# EAGLE schematic try1 (EAGLE 9.6.2)

## Sheet 1 of 2
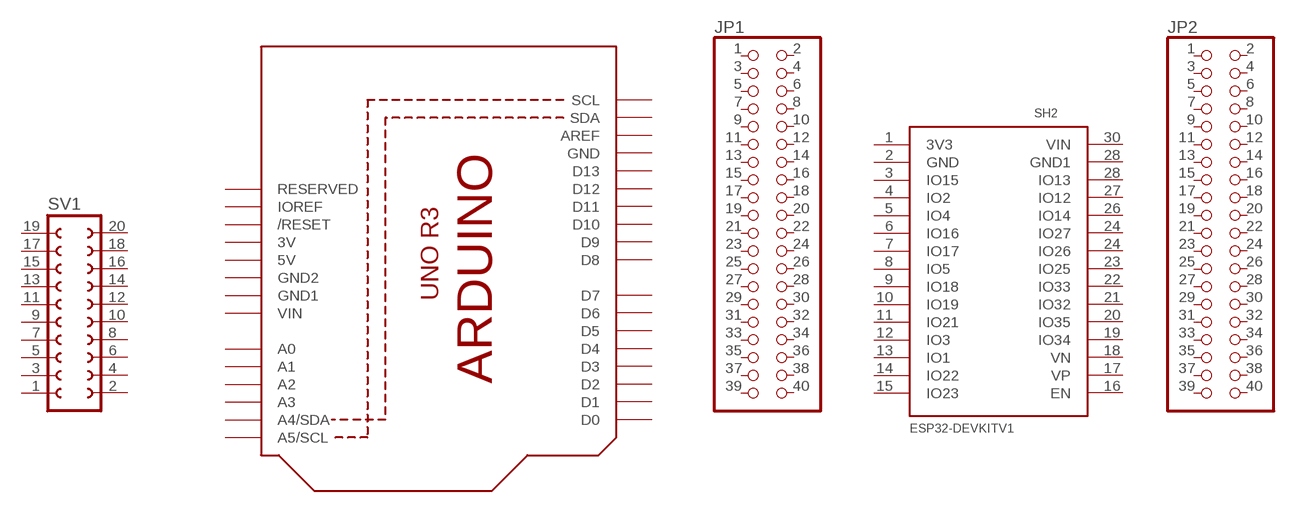
[diagram p0: schematic, sheet 1]

### Parts
JP1  PINHD-2X20  [2X20]
JP2  PINHD-2X20  [2X20]
SH1  ARDUINOR3-BPLACE  [ARDUINOR3-BPLACE]
SH2  ESP32DEVKITV1  [ESP32-DEVKITV1]
SV1  FE10-2  [FE10-2]
Unconnected: JP1.1 JP1.2 JP1.3 JP1.4 JP1.5 JP1.6 JP1.7 JP1.8 JP1.9 JP1.10 JP1.11 JP1.12 JP1.13 JP1.14 JP1.15 JP1.16 JP1.17 JP1.18 JP1.19 JP1.20 JP1.21 JP1.22 JP1.23 JP1.24 JP1.25 JP1.26 JP1.27 JP1.28 JP1.29 JP1.30 JP1.31 JP1.32 JP1.33 JP1.34 JP1.35 JP1.36 JP1.37 JP1.38 JP1.39 JP1.40 JP2.1 JP2.2 JP2.3 JP2.4 JP2.5 JP2.6 JP2.7 JP2.8 JP2.9 JP2.10 JP2.11 JP2.12 JP2.13 JP2.14 JP2.15 JP2.16 JP2.17 JP2.18 JP2.19 JP2.20 JP2.21 JP2.22 JP2.23 JP2.24 JP2.25 JP2.26 JP2.27 JP2.28 JP2.29 JP2.30 JP2.31 JP2.32 JP2.33 JP2.34 JP2.35 JP2.36 JP2.37 JP2.38 JP2.39 JP2.40 SH1.A0 SH1.A1 SH1.A2 SH1.A3 SH1.A4(A4/SDA) SH1.A5(A5/SCL) SH1.AREF SH1.D0 SH1.D1 SH1.D2 SH1.D3 SH1.D4 SH1.D5 SH1.D6 SH1.D7 SH1.D8 SH1.D9 SH1.D10 SH1.D11 SH1.D12 SH1.D13 SH1.IOREF SH1.RESERVED SH1.RESET(/RESET) SH1.SCL SH1.SDA SH2.1(3V3) SH2.2(GND) SH2.3(IO15) SH2.4(IO2) SH2.5(IO4) SH2.6(IO16) SH2.7(IO17) SH2.8(IO5) SH2.9(IO18) SH2.10(IO19) SH2.11(IO21) SH2.12(IO3) SH2.13(IO1) SH2.14(IO22) SH2.15(IO23) SH2.16(EN) SH2.17(VP) SH2.18(VN) SH2.19(IO34) SH2.20(IO35) SH2.21(IO32) SH2.22(IO33) SH2.23(IO25) SH2.24(IO26) SH2.24(IO27) SH2.26(IO14) SH2.27(IO12) SH2.28(GND1) SH2.28(IO13) SH2.30(VIN) SV1.1 SV1.2 SV1.3 SV1.4 SV1.5 SV1.6 SV1.7 SV1.8 SV1.9 SV1.10 SV1.11 SV1.12 SV1.13 SV1.14 SV1.15 SV1.16 SV1.17 SV1.18 SV1.19 SV1.20

## Sheet 2 of 2
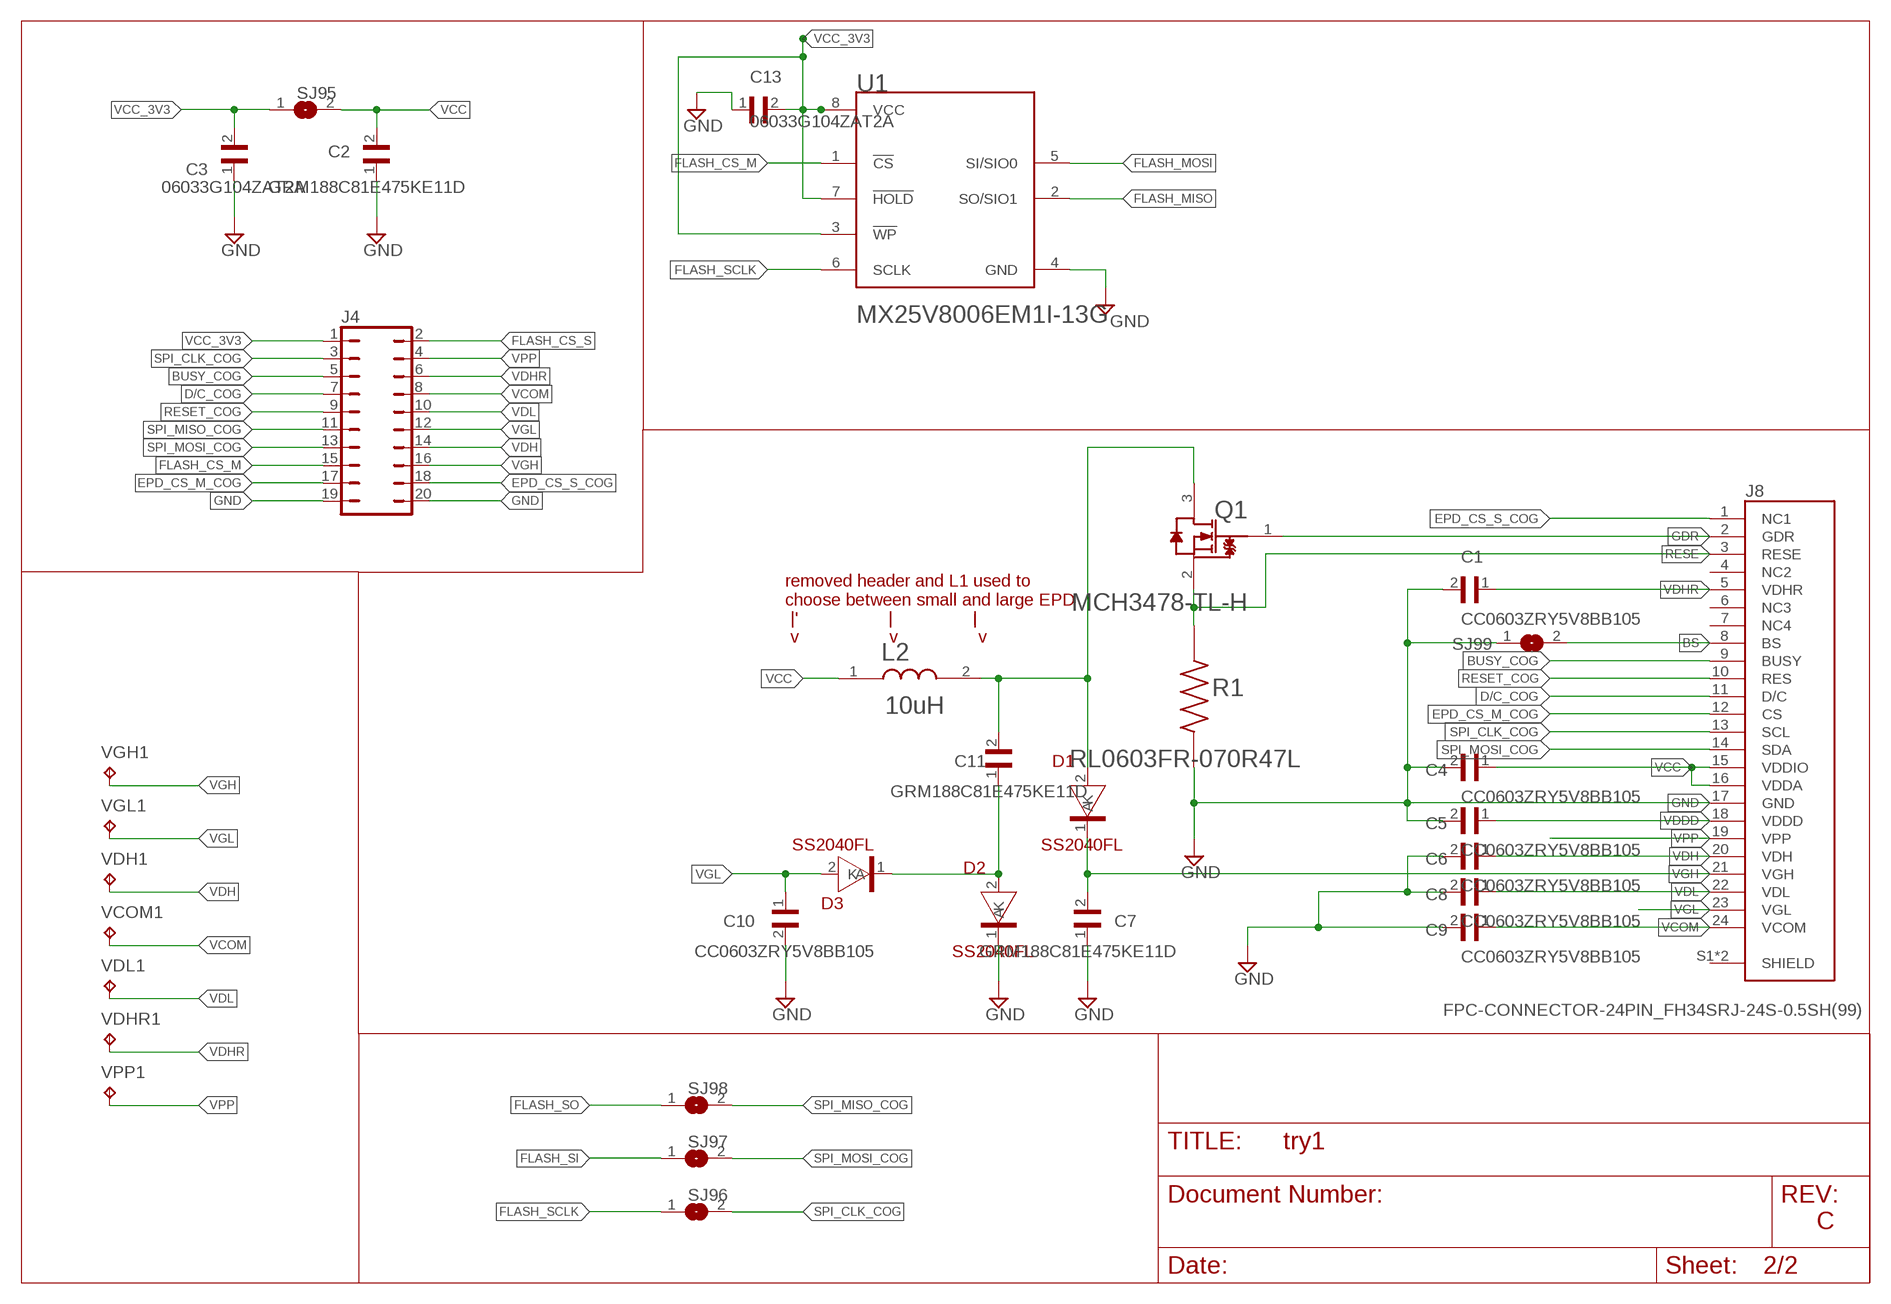
[diagram p1: schematic, sheet 2]

### Parts
C1  CC0603ZRY5V8BB105  [CAPC1608X90]
C2  GRM188C81E475KE11D  [CAPC1608X100N]
C3  06033G104ZAT2A  [CAPC1608X90N]
C4  CC0603ZRY5V8BB105  [CAPC1608X90]
C5  CC0603ZRY5V8BB105  [CAPC1608X90]
C6  CC0603ZRY5V8BB105  [CAPC1608X90]
C7  GRM188C81E475KE11D  [CAPC1608X100N]
C8  CC0603ZRY5V8BB105  [CAPC1608X90]
C9  CC0603ZRY5V8BB105  [CAPC1608X90]
C10  CC0603ZRY5V8BB105  [CAPC1608X90]
C11  GRM188C81E475KE11D  [CAPC1608X100N]
C13  06033G104ZAT2A  [CAPC1608X90N]
D1  SS2040FL  [SOD-123FL]
D2  SS2040FL  [SOD-123FL]
D3  SS2040FL  [SOD-123FL]
J4  JP10Q  [JP10Q]
J8  FPC-CONNECTOR-24PIN_FH34SRJ-24S-0.5SH(99)  [FPC-CONNECTOR-24PIN_HRS_FH34SRJ-24S-0.5SH(99)]
L2  MURATA_LQH3NPZ100MMELMURATA_LQH3NPZ100MMEL_0_0  [MURATA_LQH3NPZ100MMEL_0]
Q1  ON_SEMICONDUCTOR_MCH3478-TL-HON_SEMICONDUCTOR_MCH3478-TL-H_0_0  [ON_SEMICONDUCTOR_MCH3478-TL-H_0]
R1  RL0603FR-070R47L  [RESC1608X55N]
SJ95  SJW  [SJW]
SJ96  SJW  [SJW]
SJ97  SJW  [SJW]
SJ98  SJW  [SJW]
SJ99  SJW  [SJW]
U1  MACRONIX_MX25V8006EM1I-13GMACRONIX_MX25V8006EM1I-13G_0_0  [MACRONIX_MX25V8006EM1I-13G_0]
VCOM1  TPB1,27  [B1,27]
VDH1  TPB1,27  [B1,27]
VDHR1  TPB1,27  [B1,27]
VDL1  TPB1,27  [B1,27]
VGH1  TPB1,27  [B1,27]
VGL1  TPB1,27  [B1,27]
VPP1  TPB1,27  [B1,27]

### Nets
BS: J8.8(BS) SJ99.2
BUSY_COG: J4.5 J8.9(BUSY)
D/C_COG: J4.7 J8.11(D/C)
EPD_CS_M_COG: J4.17 J8.12(CS)
EPD_CS_S_COG: J4.18 J8.1(NC1)
FLASH_CS_M: J4.15 U1.1(!CS!)
FLASH_CS_S: J4.2
FLASH_MISO: U1.2(SO/SIO1)
FLASH_MOSI: U1.5(SI/SIO0)
FLASH_SCLK: SJ96.1 U1.6(SCLK)
FLASH_SI: SJ97.1
FLASH_SO: SJ98.1
GDR: J8.2(GDR) Q1.1(G)
GND: C1.2 C2.1 C3.1 C4.2 C5.2 C6.2 C7.1 C8.2 C9.2 C10.2 C13.1 D2.1(K) J4.19 J4.20 J8.17(GND) R1.1 SJ99.1 U1.4(GND)
N$1: C11.2 D1.2(A) L2.2 Q1.3(D)
N$15: C11.1 D2.2(A) D3.1(K)
RESE: J8.3(RESE) Q1.2(S) R1.2
RESET_COG: J4.9 J8.10(RES)
SPI_CLK_COG: J4.3 J8.13(SCL) SJ96.2
SPI_MISO_COG: J4.11 SJ98.2
SPI_MOSI_COG: J4.13 J8.14(SDA) SJ97.2
VCC: C2.2 C4.1 J8.15(VDDIO) J8.16(VDDA) L2.1 SJ95.2
VCC_3V3: C3.2 C13.2 J4.1 SJ95.1 U1.3(!WP!) U1.7(!HOLD!) U1.8(VCC)
VCOM: C9.1 J4.8 J8.24(VCOM) VCOM1.TP
VDDD: C5.1 J8.18(VDDD)
VDH: C6.1 J4.14 J8.20(VDH) VDH1.TP
VDHR: C1.1 J4.6 J8.5(VDHR) VDHR1.TP
VDL: C8.1 J4.10 J8.22(VDL) VDL1.TP
VGH: C7.2 D1.1(K) J4.16 J8.21(VGH) VGH1.TP
VGL: C10.1 D3.2(A) J4.12 J8.23(VGL) VGL1.TP
VPP: J4.4 J8.19(VPP) VPP1.TP
Unconnected: J8.4(NC2) J8.6(NC3) J8.7(NC4) J8.S1(SHIELD) J8.S2(SHIELD)

### Notes on the sheet
- removed header and L1 used to 
  choose between small and large EPD
   |'                  |                |
   v                  v                v
- C

## Power pins joined to a net without a drawn wire
3V: SH1.3V
5V: SH1.5V
GND: SH1.GND
GND1: SH1.GND1
GND2: SH1.GND2
VIN: SH1.VIN

## Library data of the parts
C1 C4-C6 C8-C10 = CAP 1uF:CC0603ZRY5V8BB105: Cap 1uF 25VDC Y5V -20% to 80% SMD 0603 Paper T/R; DESCRIPTION: 1µF -20%, +80% 25V Ceramic Capacitor Y5V (F) 0603 (1608 Metric); DIGI-KEY_PART_NUMBER: 311-1829-1-ND; MF: Yageo; MP: CC0603ZRY5V8BB105; PACKAGE: 0603 Yageo; PURCHASE-URL: https://pricing.snapeda.com/search/part/CC0603ZRY5V8BB105/?ref=eda
C2 C7 C11 = CAP 4.7uF:GRM188C81E475KE11D: Cap Ceramic 4.7uF 25V X6S 10% Pad SMD 0603 105C T/R Check prices <https://pricing.snapeda.com/parts/GRM188C81E475KE11D/Murata/view-part?ref=eda>; AVAILABILITY: In Stock; DESCRIPTION: SMD Capacitor X6S(EIA) with Capacitance: 4.7uF Tol. 10%. Rated Voltage: 25Vdc; MF: Murata; MP: GRM188C81E475KE11D; PACKAGE: 1608 Murata; PRICE: None; PURCHASE-URL: https://pricing.snapeda.com/search/part/GRM188C81E475KE11D/?ref=eda
C3 C13 = CAP 100nF:06033G104ZAT2A: 0603 100 nF 25 V -20 / +80 % Tolerance Y5V SMT Multilayer Ceramic Capacitor; DESCRIPTION: Cap Ceramic 0.1uF 25V Y5V -20% to 80% Pad SMD 0603 85°C T/R; MF: AVX; MP: 06033G104ZAT2A; PACKAGE: None; PURCHASE-URL: https://pricing.snapeda.com/search/part/06033G104ZAT2A/?ref=eda
D1-D3 = DIODE:SS2040FL: Check prices <https://pricing.snapeda.com/parts/SS2040FL/Panjit/view-part?ref=eda>; AVAILABILITY: In Stock; DESCRIPTION: Schottky Diodes & Rectifiers GP/TR/13/RoHS/10K/SOD-123FL/SKY/SOD/SSM-20AAFL/SSM20FL-QI02/PJ///; MF: Panjit; MP: SS2040FL; PACKAGE: None; PRICE: None; PURCHASE-URL: https://pricing.snapeda.com/search/part/SS2040FL/?ref=eda
J4 = jumper:JP10Q: JUMPER
J8 = ESL:FPC-CONNECTOR-24PIN_FH34SRJ-24S-0.5SH(99): FFC & FPC Connectors Check prices <https://pricing.snapeda.com/parts/FH34SRJ-24S-0.5SH%2899%29/Hirose%20Electric/view-part?ref=eda>; AVAILABILITY: In Stock; DESCRIPTION: 24 Position FFC, FPC Connector Contacts, Top and Bottom 0.020 (0.50mm) Surface Mount, Right Angle; MF: Hirose Electric; MP: FH34SRJ-24S-0.5SH(99); PACKAGE: None; PRICE: None; PURCHASE-URL: https://pricing.snapeda.com/search/part/FH34SRJ-24S-0.5SH(99)/?ref=eda
JP1 JP2 = pinhead:PINHD-2X20: PIN HEADER
L2 = IND 10uH:MURATA_LQH3NPZ100MMEL: Wire Wound Ferrite Inductor for Power Lines For Automotive 10μH ±20% 0.228Ω 1280mA 1212; AMBIENT_TEMPERATURE_RANGE_HIGH: +105°C; AMBIENT_TEMPERATURE_RANGE_LOW: -40°C; AUTOMOTIVE: Yes; AUTOMOTIVE_GRADE: Grade 1; CENTROID_NOT_SPECIFIED: No; COMPOSITION: Wirewound; CORE_MATERIAL: Ferrite; DATASHEET: https://www.murata.com/en-us/products/productdetail?partno=LQH3NPZ100MME%23; DEVICE_CLASS_L1: Passive Components; DEVICE_CLASS_L2: Inductors; DEVICE_CLASS_L3: Fixed Inductors; FOOTPRINT_VARIANT_NAME_0: Recommended_Land_Pattern; HEIGHT: 1.5mm; INDUCTANCE: 10uH; LEAD_FREE: Yes; MF: Murata; MFG_PACKAGE_IDENT: LQH3NPH_ME; MFG_PACKAGE_IDENT_COMPONENT_ID: a63315cd171c542c; MFG_PACKAGE_IDENT_DATE: 0; MFG_PACKAGE_IDENT_REV: 0; MPN: LQH3NPZ100MMEL; PACKAGE: 1212.0; PREFIX: L; RMS_CURRENT: 1280mA; ROHS: Yes; SATURATION_CURRENT: 810mA; SELF_RESONANT_FREQUENCY: 20MHz; SERIES_RESISTANCE: 0.228Ω; SHIELDING: true; TEMPERATURE_RANGE_HIGH: +125°C; TEMPERATURE_RANGE_LOW: -40°C; TEST_FREQUENCY: 1MHz; TOLERANCE: 0.2; VERIFICATION_VERSION: 0.0.0.3
Q1 = MOSFET:ON_SEMICONDUCTOR_MCH3478-TL-H: ONSC-NMOS-G1S2D3-3_J; CHANNEL_POLARITY: N Channel; CIIVA_IDS: 837008; CISS_TYP_PF: 130; COMPONENT_LINK_1_DESCRIPTION: Manufacturer URL; COMPONENT_LINK_1_URL: http://www.onsemi.com/; COMPONENT_LINK_3_DESCRIPTION: Package Specification; COMPONENT_LINK_3_URL: http://www.onsemi.com/pub_link/Collateral/EN7354-D.PDF; CONFIGURATION: Single; COSS_TYP_PF: 21; CRSS_TYP_PF: 14; DATASHEET: http://www.onsemi.cn/pub_link/Collateral/ENAA1353-D.PDF; FOOTPRINT_VARIANT_NAME_0: Manufacturer Recommended; IMPORTED: yes; IMPORTED_FROM: vault; IMPORT_TS: 1521851194; MF: On Semiconductor; MOUNTING_TECHNOLOGY: Surface Mount; MPN: MCH3478-TL-H; PACKAGE: MCPH-3; PACKAGE_DESCRIPTION: 3-Pin Small Outline Transistor, Body 2 x 1.6 mm, Pitch 0.65 mm; PACKAGE_TYPE: SC-70FL / MCPH-3; PACKING: Tape and Reel; PREFIX: Q; RELEASE_DATE: 1407149804; ROHS: No; VAULT_GUID: 93CF8D5F-116E-4A84-9C4D-567819B75567; VAULT_REVISION: 4F433114-B412-42D1-93FA-4D10C81BF666; VBRDSS_MIN_V: 30; VGSTH_MAX_V: 1.3; VGS_MAX_V: 12
R1 = RES .47ohm:RL0603FR-070R47L: Surface Mount Thick Film Resistor, RL Series, 0.47 ohm, 100 mW, - 1%, 50 V, 0603 [1608 Metric] Check prices <https://pricing.snapeda.com/parts/RL0603FR-070R47L/Yageo/view-part?ref=eda>; AVAILABILITY: In Stock; DESCRIPTION: 470 mOhms ±1% 0.1W, 1/10W Chip Resistor 0603 (1608 Metric) Automotive AEC-Q200, Current Sense, Moisture Resistant Thick Film; MF: Yageo; MP: RL0603FR-070R47L; PACKAGE: 1608 Yageo; PRICE: None; PURCHASE-URL: https://pricing.snapeda.com/search/part/RL0603FR-070R47L/?ref=eda
SH1 = adafruit:ARDUINOR3: This is a new object for the new Arduino R3 - with extra pins that you may want to use (such as IOref, and duplicated A4/A5
SH2 = ESP32-DEVKITV1:ESP32DEVKITV1
SJ95-SJ99 = jumper:SJ: SMD solder JUMPER
SV1 = con-lsta:FE10-2: FEMALE HEADER; OC_FARNELL: unknown; OC_NEWARK: unknown
U1 = Flash Memory:MACRONIX_MX25V8006EM1I-13G: FLASH - NOR Memory IC 8Mb (1M x 8) SPI 75MHz 8-SOP; 3DS_PART_NUMBER: 521-00003; ACCESS_TIME: 9us; AMBIENT_TEMPERATURE_RANGE_HIGH: +85°C; AMBIENT_TEMPERATURE_RANGE_LOW: -40°C; CENTROID_NOT_SPECIFIED: No; DATASHEET: https://media.digikey.com/pdf/Data%20Sheets/Macronix/MX25V8006E.pdf; DEVICE_CLASS_L1: Integrated Circuits (ICs); DEVICE_CLASS_L2: Memory; DEVICE_CLASS_L3: Flash; DIGIKEY_DESCRIPTION: IC FLASH 8MBIT 75MHZ 8SOP; DIGIKEY_PART_NUMBER: 1092-1118-ND; FOOTPRINT_PARAMETERS_0: {"fp_type":"SOIC_mini","params":{"N":{"nom":8,"long name":"Number of leads","min":null,"max":null,"short name":"N","type":"count"},"A":{"nom":false,"long name":"Height","min":false,"max":1750000,"short name":"A","type":"measurement"},"A1":{"nom":150000,"long name":"Package clearance","min":100000,"max":200000,"short name":"A1","type":"measurement"},"A2":{"nom":1450000,"long name":"Package height","min":1350000,"max":1550000,"short name":"A2","type":"measurement"},"D":{"nom":4900000,"long name":"Package length","min":4770000,"max":5030000,"short name":"D","type":"measurement"},"E":{"nom":5990000,"long name":"Width w/ leads","min":5800000,"max":6200000,"short name":"E","type":"measurement"},"E1":{"nom":3900000,"long name":"Package width","min":3800000,"max":4000000,"short name":"E1","type":"measurement"},"B":{"nom":410000,"long name":"Lead width","min":360000,"max":510000,"short name":"B","type":"measurement"},"C":{"nom":200000,"long name":"Lead thickness","min":150000,"max":250000,"short name":"C","type":"measurement"},"e":{"nom":1270000,"long name":"Lead pitch","min":null,"max":null,"short name":"e","type":"measurement"},"L":{"nom":660000,"long name":"Lead foot length","min":460000,"max":860000,"short name":"L","type":"measurement"},"PHI":{"nom":5,"long name":"Lead foot angle","min":0,"max":8,"short name":"PHI","type":"measurement"},"HT":{"default":"No","long name":"Thermal pad","type":"multichoiceparent","short name":"HT","children":[]},"offset x":{"nom":0,"long name":"X Center offset","min":null,"max":null,"short name":"offset x","type":"measurement"},"offset y":{"nom":0,"long name":"Y Center offset","min":null,"max":null,"short name":"offset y","type":"measurement"},"LS":{"default":"Rounded rectangle","long name":"Land shape","type":"multichoice","short name":"LS"},"LS1":{"default":"Rectangle","long name":"Land shape (Pin 1)","type":"multichoice","short name":"LS1"},"solder toe":{"nom":550000,"long name":"Solder fillet (toe)","min":null,"max":null,"short name":"solder toe","type":"fixedmeasurement"},"solder heel":{"nom":450000,"long name":"Solder fillet (heel)","min":null,"max":null,"short name":"solder heel","type":"fixedmeasurement"},"solder side":{"nom":50000,"long name":"Solder fillet (side)","min":null,"max":null,"short name":"solder side","type":"fixedmeasurement"},"courtyard":{"nom":500000,"long name":"Courtyard","min":null,"max":null,"short name":"courtyard","type":"fixedmeasurement"},"SF":{"default":"A","long name":"Packing level","type":"multichoiceparent","short name":"SF","help":"http://support.upverter.com/customer/portal/articles/978783-what-is-a-footprint-packing-level","children":["solder toe","solder heel","solder side","courtyard"]}}}; FOOTPRINT_PARAMETERS_1: {"fp_type":"SOIC_mini","params":{"N":{"nom":8,"long name":"Number of leads","min":null,"max":null,"short name":"N","type":"count"},"A":{"nom":false,"long name":"Height","min":false,"max":1750000,"short name":"A","type":"measurement"},"A1":{"nom":150000,"long name":"Package clearance","min":100000,"max":200000,"short name":"A1","type":"measurement"},"A2":{"nom":1450000,"long name":"Package height","min":1350000,"max":1550000,"short name":"A2","type":"measurement"},"D":{"nom":4900000,"long name":"Package length","min":4770000,"max":5030000,"short name":"D","type":"measurement"},"E":{"nom":5990000,"long name":"Width w/ leads","min":5800000,"max":6200000,"short name":"E","type":"measurement"},"E1":{"nom":3900000,"long name":"Package width","min":3800000,"max":4000000,"short name":"E1","type":"measurement"},"B":{"nom":410000,"long name":"Lead width","min":360000,"max":510000,"short name":"B","type":"measurement"},"C":{"nom":200000,"long name":"Lead thickness","min":150000,"max":250000,"short name":"C","type":"measurement"},"e":{"nom":1270000,"long name":"Lead pitch","min":null,"max":null,"short name":"e","type":"measurement"},"L":{"nom":660000,"long name":"Lead foot length","min":460000,"max":860000,"short name":"L","type":"measurement"},"PHI":{"nom":5,"long name":"Lead foot angle","min":0,"max":8,"short name":"PHI","type":"measurement"},"HT":{"default":"No","long name":"Thermal pad","type":"multichoiceparent","short name":"HT","children":[]},"offset x":{"nom":0,"long name":"X Center offset","min":null,"max":null,"short name":"offset x","type":"measurement"},"offset y":{"nom":0,"long name":"Y Center offset","min":null,"max":null,"short name":"offset y","type":"measurement"},"LS":{"default":"Rounded rectangle","long name":"Land shape","type":"multichoice","short name":"LS"},"LS1":{"default":"Rectangle","long name":"Land shape (Pin 1)","type":"multichoice","short name":"LS1"},"solder toe":{"nom":350000,"long name":"Solder fillet (toe)","min":null,"max":null,"short name":"solder toe","type":"fixedmeasurement"},"solder heel":{"nom":350000,"long name":"Solder fillet (heel)","min":null,"max":null,"short name":"solder heel","type":"fixedmeasurement"},"solder side":{"nom":30000,"long name":"Solder fillet (side)","min":null,"max":null,"short name":"solder side","type":"fixedmeasurement"},"courtyard":{"nom":250000,"long name":"Courtyard","min":null,"max":null,"short name":"courtyard","type":"fixedmeasurement"},"SF":{"default":"B","long name":"Packing level","type":"multichoiceparent","short name":"SF","help":"http://support.upverter.com/customer/portal/articles/978783-what-is-a-footprint-packing-level","children":["solder toe","solder heel","solder side","courtyard"]}}}; FOOTPRINT_PARAMETERS_2: {"fp_type":"SOIC_mini","params":{"N":{"nom":8,"long name":"Number of leads","min":null,"max":null,"short name":"N","type":"count"},"A":{"nom":false,"long name":"Height","min":false,"max":1750000,"short name":"A","type":"measurement"},"A1":{"nom":150000,"long name":"Package clearance","min":100000,"max":200000,"short name":"A1","type":"measurement"},"A2":{"nom":1450000,"long name":"Package height","min":1350000,"max":1550000,"short name":"A2","type":"measurement"},"D":{"nom":4900000,"long name":"Package length","min":4770000,"max":5030000,"short name":"D","type":"measurement"},"E":{"nom":5990000,"long name":"Width w/ leads","min":5800000,"max":6200000,"short name":"E","type":"measurement"},"E1":{"nom":3900000,"long name":"Package width","min":3800000,"max":4000000,"short name":"E1","type":"measurement"},"B":{"nom":410000,"long name":"Lead width","min":360000,"max":510000,"short name":"B","type":"measurement"},"C":{"nom":200000,"long name":"Lead thickness","min":150000,"max":250000,"short name":"C","type":"measurement"},"e":{"nom":1270000,"long name":"Lead pitch","min":null,"max":null,"short name":"e","type":"measurement"},"L":{"nom":660000,"long name":"Lead foot length","min":460000,"max":860000,"short name":"L","type":"measurement"},"PHI":{"nom":5,"long name":"Lead foot angle","min":0,"max":8,"short name":"PHI","type":"measurement"},"HT":{"default":"No","long name":"Thermal pad","type":"multichoiceparent","short name":"HT","children":[]},"offset x":{"nom":0,"long name":"X Center offset","min":null,"max":null,"short name":"offset x","type":"measurement"},"offset y":{"nom":0,"long name":"Y Center offset","min":null,"max":null,"short name":"offset y","type":"measurement"},"LS":{"default":"Rounded rectangle","long name":"Land shape","type":"multichoice","short name":"LS"},"LS1":{"default":"Rectangle","long name":"Land shape (Pin 1)","type":"multichoice","short name":"LS1"},"solder toe":{"nom":150000,"long name":"Solder fillet (toe)","min":null,"max":null,"short name":"solder toe","type":"fixedmeasurement"},"solder heel":{"nom":250000,"long name":"Solder fillet (heel)","min":null,"max":null,"short name":"solder heel","type":"fixedmeasurement"},"solder side":{"nom":10000,"long name":"Solder fillet (side)","min":null,"max":null,"short name":"solder side","type":"fixedmeasurement"},"courtyard":{"nom":100000,"long name":"Courtyard","min":null,"max":null,"short name":"courtyard","type":"fixedmeasurement"},"SF":{"default":"C","long name":"Packing level","type":"multichoiceparent","short name":"SF","help":"http://support.upverter.com/customer/portal/articles/978783-what-is-a-footprint-packing-level","children":["solder toe","solder heel","solder side","courtyard"]}}}; FOOTPRINT_URL: http://www.macronix.com/Lists/ApplicationNote/Attachments/1897/AN0239V1%20-%20Macronix%20150mil%208SOP_6x5mm8WSON_dual%20layout.pdf; FOOTPRINT_VARIANT_NAME_0: IPC_A; FOOTPRINT_VARIANT_NAME_1: IPC_B; FOOTPRINT_VARIANT_NAME_2: IPC_C; FOOTPRINT_VARIANT_NAME_3: Recommended_Land_Pattern; FREQUENCY: 75MHz; HEIGHT: 1.75mm; INTERFACE: SPI; IPC_LAND_PATTERN_NAME: SOIC127P599X175-8; LEAD_FREE: yes; MAX_SUPPLY_VOLTAGE: 3.6V; MEMORY_SIZE: 8MB; MEMORY_TYPE: FLASH; MF: Macronix; MFG_PACKAGE_IDENT: SOP-8; MFG_PACKAGE_IDENT_DATE: 11-26-03; MFG_PACKAGE_IDENT_REV: 6; MIN_SUPPLY_VOLTAGE: 2.35V; MPN: MX25V8006EM1I-13G; NOMINAL_SUPPLY_CURRENT: 12mA; PACKAGE: SOP8; PREFIX: U; ROHS: yes; STANDOFF_HEIGHT: 0.15mm; TEMPERATURE_RANGE_HIGH: +85°C; TEMPERATURE_RANGE_LOW: -40°C
VCOM1 VDH1 VDHR1 VDL1 VGH1 VGL1 VPP1 = testpad:TP: Test pad